# Altium schematic sheet SIM_Connector.SchDoc
size A3; ApprovedBy: Mustafa Atılay Beycan; CheckedBy: Mustafa Atılay Beycan; Author: Mustafa Atılay Beycan; CompanyName: Mustafa Atılay Beycan; DrawnBy: Mustafa Atılay Beycan; Engineer: Mustafa Atılay Beycan; Organization: Mustafa Atılay Beycan; SheetNumber: 7; SheetTotal: 8; FilePath: https://github.com/mustafaatilay/Outdoor-Tracking-Project
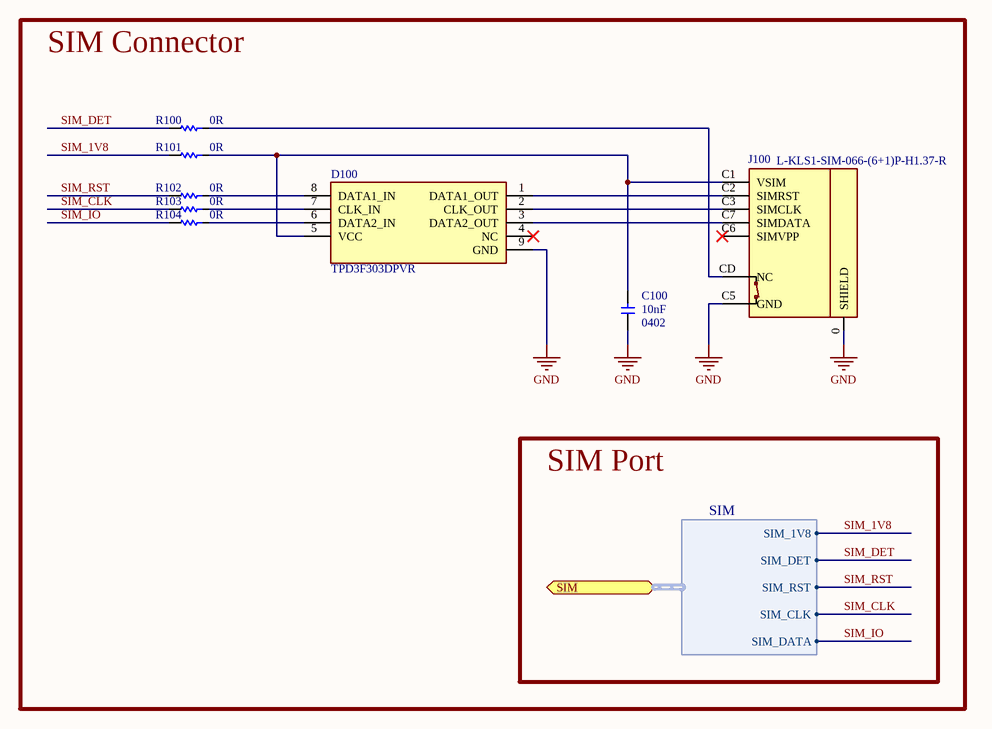
[diagram p0: SIM_Connector.SchDoc]

## Parts
C100  Capacitance: 10nF  Package: 0402  [CAP 0402]  (hidden comment: 10nF 10% X7R 16V 0402 SMD)
D100  TPD3F303DPVR  [IC 8-UFDFN Exposed Pad]
J100  L-KLS1-SIM-066-(6+1)P-H1.37-R  [CONN L-KLS1-SIM-066-(6+1)P-H1]
R100  Resistance: 0R  [RES 0402]  (hidden comment: 0R 5% * 0402 SMD)
R101  Resistance: 0R  [RES 0402]  (hidden comment: 0R 5% * 0402 SMD)
R102  Resistance: 0R  [RES 0402]  (hidden comment: 0R 5% * 0402 SMD)
R103  Resistance: 0R  [RES 0402]  (hidden comment: 0R 5% * 0402 SMD)
R104  Resistance: 0R  [RES 0402]  (hidden comment: 0R 5% * 0402 SMD)

## Ports
SIM (bidir, harness SIM)

## Harnesses
SIM: SIM_1V8, SIM_DET, SIM_RST, SIM_CLK, SIM_DATA

## Nets
GND: C100.2 D100.9(GND) J100.0(SHIELD) J100.C5(GND)
SIM_1V8: R101.2 ; port SIM.SIM_1V8
SIM_CLK: R103.2 ; port SIM.SIM_CLK
SIM_DET: R100.2 ; port SIM.SIM_DET
SIM_IO: R104.2 ; port SIM.SIM_DATA
SIM_RST: R102.2 ; port SIM.SIM_RST
NetC100_1: C100.1 D100.5(VCC) J100.C1(VSIM) R101.1
NetD100_1: D100.1(DATA1_OUT) J100.C2(SIMRST)
NetD100_2: D100.2(CLK_OUT) J100.C3(SIMCLK)
NetD100_3: D100.3(DATA2_OUT) J100.C7(SIMDATA)
NetD100_6: D100.6(DATA2_IN) R104.1
NetD100_7: D100.7(CLK_IN) R103.1
NetD100_8: D100.8(DATA1_IN) R102.1
NetJ100_CD: J100.CD(NC) R100.1

Not connected (* = marked no-connect by the designer): D100 4(NC)*; J100 C6(SIMVPP)*

## Notes on the sheet
- SIM Connector
- SIM Port
- Project Name
- Designed by
- Schematic Name
- Checked by
- Page Size
- File Path
- Modified Date
- Revision No
- Sheet
- of
- A3

## Library data of the parts
C100 = CAP 0402 10nF 16V: ALT MALZEME KODU: 1.009.00283; Link: *; Manufacturer: *; Manufacturer Part Number: *; Value: 10nF 10% X7R 16V 0402 SMD; Tolerance: 10%; TemperatureCoefficient: X7R; Mount: SMD; Voltage: 16V
D100 = IC TPD3F303DPVR: FILTER RC(PI) ESD SMD; Manufacturer: Texas Instruments; Type: Low Pass; Filter Order: 2nd; Number of Channels: 3; Center / Cutoff Frequency: 294MHz, 308MHz (Cutoff); Resistance - Channel (Ohms): 47, 100; Values: R = 47Ohms, 100Ohms, C = 20pF; ESD Protection: Yes; Link: https://bit.ly/475RMgT; Manufacturer Product Number: TPD3F303DPVR; Technology: RC (Pi); Applications: Data Lines for Mobile Devices
J100 = CONN L-KLS1-SIM-066-(6+1)P-H1.37-R: CONNECTOR HOLDER SIM CARD (6+1) PUSH-PUSH TYPE; Manufacturer: KLS ELECTRONIC; Ejector Side: Right; Card Type: Sim Card Connectors; Link: https://bit.ly/3WZrGro; Series: KLS1-SIM-066; Number of Pins: 7(6+1); Insertion, Removal Method: Push-Push
R100-R104 = RES 0402 0R 5%: ALT MALZEME KODU: 1.031.00612; Link: *; Manufacturer: *; Manufacturer Part Number: *; Value: 0R 5% * 0402 SMD; Tolerance: 5%; PowerRating: *; Mount: SMD; Package: 0402